# Altium schematic sheet Industrial-Controller_PWR_Switch.SchDoc: DC/DC Step-Down Converter 12V
size 279 x 215 mm; Date: not used; ApprovedBy: not used; CheckedBy: not used; Author: not used; DrawnBy: not used; Organization: not used; Address4: not used; SheetNumber: 4; SheetTotal: 21; Time: not used; ImagePath: not used; Application_BuildNumber: not used
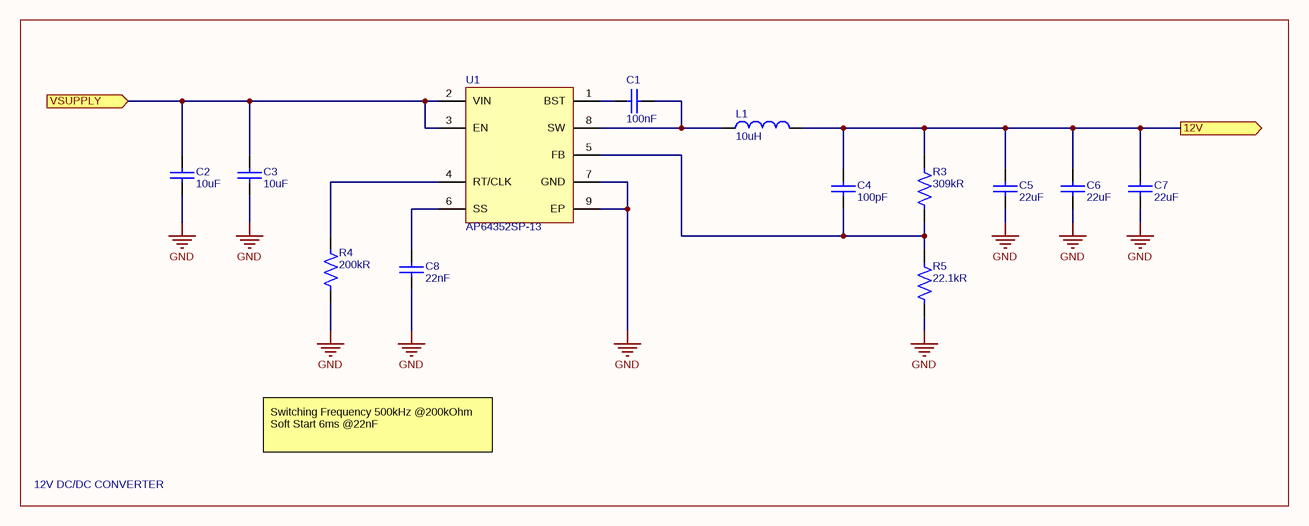
[diagram p0: Industrial-Controller_PWR_Switch.SchDoc]

## Parts
C1  100nF  [CAP_0603]
C2  10uF  [CAP_1210]
C3  10uF  [CAP_1210]
C4  100pF  [CAP_0603]
C5  22uF  [CAP_1210]
C6  22uF  [CAP_1210]
C7  22uF  [CAP_1210]
C8  22nF  [CAP_0603]
L1  10uH  [SRU1048]
R3  309kR  [RES_0603]
R4  200kR  [RES_0603]
R5  22.1kR  [RES_0603]
U1  AP64352SP-13  [SOIC-8EP_150mil]

## Blocks framed on the sheet
12V DC/DC CONVERTER: C1-C8 L1 R3-R5 U1

## Ports
12V (out), VSUPPLY (in)

## Nets
GND: C2.1 C3.1 C5.1 C6.1 C7.1 C8.1 R4.2 R5.2 U1.7(GND) U1.9(EP)
12V: C4.2 C5.2 C6.2 C7.2 L1.2 R3.1 ; port 12V
VSUPPLY: C2.2 C3.2 U1.2(VIN) U1.3(EN) ; port VSUPPLY
NetC1_1: C1.1 L1.1 U1.8(SW)
NetC1_2: C1.2 U1.1(BST)
NetC4_1: C4.1 R3.2 R5.1 U1.5(FB)
NetC8_2: C8.2 U1.6(SS)
NetR4_1: R4.1 U1.4(RT/CLK)

## Notes on the sheet
- Switching Frequency 500kHz @200kOhm
  Soft Start 6ms @22nF
- Title:
- Date:
- Size A
- Project:
- Number:
- Time:
- Sheet
- Revision
- of
- Engineer:
- www.rft.com <http://www.rft.com>
- File:

## Library data of the parts
C1 = CL10B104KB8NNNL: CAP CER 0.1UF 50V X7R 0603; Manufacturer 1: Samsung; Tolerance: 10%; Supplier 1: Digi-Key; Manufacturer Part Number 1: CL10B104KB8NNNL; RoHS: Yes; Category: Ceramic Capacitors; Stock 1: 2348404; Pricing 1: 15000=0,00532, 30000=0,00506 (USD); Mount: Surface Mount; Case/Package: 0603; Min Operating Temperature: -55°C; Max Operating Temperature: 125°C; Capacitance: 100nF; Packaging: Tape and Reel; Package Quantity: 15000; Voltage Rating: 50V; Dielectric: X7R; Voltage Rating (DC): 50V; Series: CL; Construction: Flat; Length: 1.6mm; Width: 0.031inch; Height: 0.8mm; Thickness: 0.035inch; Depth: 0.8mm; Radiation Hardening: No; RoHS Compliant: Yes; ComponentLink1URL: https://datasheet.ciiva.com/26838/getdatasheetpartid-357523-26838415.pdf?src-supplier=Verical; ComponentLink1Description: https://datasheet.ciiva.com/26838/getdatasheetpartid-357523-26838415.pdf?src-supplier=Verical; ComponentLink2URL: https://datasheet.ciiva.com/25741/cl10b104kb8nnnl-25741341.pdf?src-supplier=Digi-Key; ComponentLink2Description: https://datasheet.ciiva.com/25741/cl10b104kb8nnnl-25741341.pdf?src-supplier=Digi-Key; Supplier Part Number 1: 1276-CL10B104KB8NNNLTR-ND
C2 C3 = CL32B106KBJNNWE: CAP CER 10UF 50V X7R 1210; Manufacturer 1: Samsung; Tolerance: 10%; Supplier 1: Digi-Key; Manufacturer Part Number 1: CL32B106KBJNNWE; RoHS: Yes; Category: Ceramic Capacitors; Stock 1: 395336; Pricing 1: 1=0,64000, 10=0,45500, 50=0,34380, 100=0,29940, 500=0,22176 (USD); Mount: Surface Mount; Case/Package: 1210; Case Code (Imperial): 1210; Case Code (Metric): 3225; Min Operating Temperature: -55°C; Max Operating Temperature: 125°C; Dielectric: X7R; Capacitance: 10uF; Voltage Rating: 50V; Package Quantity: 1; Packaging: Tape and Reel; Length: 0.126inch; Width: 0.098inch; Thickness: 0.106inch; Lead Free: Lead Free; ComponentLink1URL: https://datasheet.ciiva.com/25721/cl32b106kbjnnwe-25721651.pdf?src-supplier=Digi-Key; ComponentLink1Description: https://datasheet.ciiva.com/25721/cl32b106kbjnnwe-25721651.pdf?src-supplier=Digi-Key; Supplier Part Number 1: 1276-3388-1-ND
C4 = CL10B101KB8NFNC: CAP CER 100PF 50V X7R 0603; Manufacturer 1: Samsung; Tolerance: 10%; Supplier 1: Digi-Key; Manufacturer Part Number 1: CL10B101KB8NFNC; RoHS: Yes; Category: Ceramic Capacitors; Stock 1: 134085; Pricing 1: 1=0,10000, 10=0,04200, 50=0,02260, 100=0,01850, 500=0,01320, 1000=0,01038 (USD); Mount: Surface Mount; Case/Package: 0603; Case Code (Metric): 1608; Case Code (Imperial): 0603; Contact Plating: Tin; Min Operating Temperature: -55°C; Max Operating Temperature: 125°C; Package Quantity: 1; Packaging: Cut Tape; Capacitance: 100pF; Voltage Rating: 50V; Dielectric: X7R; Termination: Wraparound; Series: CL; Construction: Flat; Length: 0.063inch; Width: 0.031inch; Thickness: 0.035inch; RoHS Compliant: Yes; ComponentLink1URL: https://datasheet.ciiva.com/25739/cl10b101kb8nfnc-25739520.pdf?src-supplier=Digi-Key; ComponentLink1Description: https://datasheet.ciiva.com/25739/cl10b101kb8nfnc-25739520.pdf?src-supplier=Digi-Key; Supplier Part Number 1: 1276-1908-1-ND
C5-C7 = CL32B226KAJNNNE: CAP CER 22UF 25V X7R 1210; Manufacturer 1: Samsung; Material: Ceramic; Tolerance: 10%; Supplier 1: Digi-Key; Manufacturer Part Number 1: CL32B226KAJNNNE; RoHS: Yes; Category: Ceramic Capacitors; Stock 1: 784003; Pricing 1: 1=0,58000, 10=0,41000, 50=0,31000, 100=0,26990, 500=0,19996 (USD); Mount: Surface Mount; Case/Package: 1210; Case Code (Metric): 3225; Case Code (Imperial): 1210; Min Operating Temperature: -55°C; Max Operating Temperature: 125°C; Package Quantity: 1; Packaging: Tape and Reel; Capacitance: 22uF; Voltage Rating: 25V; Dielectric: X7R; Series: CL; Construction: Flat; Voltage Rating (DC): 25V; Length: 3.2mm; Width: 0.098inch; Height: 2.5mm; Thickness: 0.106inch; Depth: 2.5mm; Radiation Hardening: No; RoHS Compliant: Yes; Lead Free: Lead Free; ComponentLink1URL: https://datasheet.ciiva.com/25714/cl32b226kajnnne-25714610.pdf?src-supplier=Digi-Key; ComponentLink1Description: https://datasheet.ciiva.com/25714/cl32b226kajnnne-25714610.pdf?src-supplier=Digi-Key; Supplier Part Number 1: 1276-3392-1-ND
C8 = CL10B223KB8WPNC: CAP CER 0.022UF 50V X7R 0603; Manufacturer 1: Samsung; Tolerance: 10%; Supplier 1: Digi-Key; Manufacturer Part Number 1: CL10B223KB8WPNC; RoHS: Yes; Category: Ceramic Capacitors; Stock 1: 1346669; Pricing 1: 1=0,10000, 10=0,06000, 50=0,03260, 100=0,02660, 500=0,01902, 1000=0,01494 (USD); Mount: Surface Mount; Case/Package: 0603; Case Code (Metric): 1608; Case Code (Imperial): 0603; Min Operating Temperature: -55°C; Max Operating Temperature: 125°C; Capacitance: 22nF; Packaging: Tape and Reel; Voltage Rating: 50V; Features: Soft Termination; Length: 0.063inch; Width: 0.031inch; Thickness: 0.035inch; Ratings: AEC-Q200; RoHS Compliant: Yes; ComponentLink1URL: http://www.samsungsem.com/servlet/FileDownload?type=spec&file=CL10B223KB8WPNC.pdf&src-supplier=Avnet; ComponentLink1Description: http://www.samsungsem.com/servlet/FileDownload?type=spec&file=CL10B223KB8WPNC.pdf&src-supplier=Avnet; ComponentLink2URL: http://www.samsungsem.com/kr/support/product-search/mlcc/CL10B223KB8WPNC.jsp?src-supplier=Digi-Key; ComponentLink2Description: http://www.samsungsem.com/kr/support/product-search/mlcc/CL10B223KB8WPNC.jsp?src-supplier=Digi-Key; ComponentLink3URL: http://www.samsungsem.com/kr/support/library/product-catalog/mlcc.jsp?src-supplier=Digi-Key; ComponentLink3Description: http://www.samsungsem.com/kr/support/library/product-catalog/mlcc.jsp?src-supplier=Digi-Key; Supplier Part Number 1: 1276-6534-1-ND
L1 = SRU1048-100Y: FIXED IND 10UH 4.5A 18.5MOHM SMD; Manufacturer 1: Bourns; Core Material: Ferrite; Tolerance: 30%; DC Resistance (DCR): 18.5mR; Q Factor: 26; Self Resonant Frequency: 16MHz; Saturation Current: 3.7A; Shielding: Shielded; Test Frequency: 100kHz; Supplier 1: Digi-Key; Manufacturer Part Number 1: SRU1048-100Y; RoHS: Yes; Category: Fixed Inductors; Stock 1: 5139; Pricing 1: 1=1,15000, 10=1,06400, 25=0,98200, 50=0,81840, 100=0,76930, 250=0,68744 (USD); Mount: Surface Mount; Case/Package: 1048; Min Operating Temperature: -40°C; Max Operating Temperature: 125°C; Inductance: 10uH; Max DC Current: 4.5A; Inductance Tolerance: 30%; Packaging: Tape and Reel; Package Quantity: 600; Current Rating: 4.5A; Resistor Type: Wirewound; Termination: SMD/SMT; RMS Current (Irms): 4.5A; DC Current: 4.5A; Series: SRU1048; Length: 10mm; Width: 0.394inch; Height: 4.8mm; Height - Seated (Max): 0.201inch; Depth: 10.3mm; Radiation Hardening: No; REACH SVHC: No SVHC; Military Standard: Not; RoHS Compliant: Yes; ComponentLink1URL: https://datasheet.ciiva.com/6160/1776938-6160914.pdf?src-supplier=Farnell; ComponentLink1Description: https://datasheet.ciiva.com/6160/1776938-6160914.pdf?src-supplier=Farnell; ComponentLink2URL: https://datasheet.ciiva.com/22704/1843976-22704103.pdf?src-supplier=Element14; ComponentLink2Description: https://datasheet.ciiva.com/22704/1843976-22704103.pdf?src-supplier=Element14; ComponentLink3URL: https://datasheet.ciiva.com/11799/0900766b80ddd3fc-11799736.pdf?src-supplier=RSComponents; ComponentLink3Description: https://datasheet.ciiva.com/11799/0900766b80ddd3fc-11799736.pdf?src-supplier=RSComponents; ComponentLink4URL: https://datasheet.ciiva.com/1062/sru1048-1062388.pdf?src-supplier=Digi-Key; ComponentLink4Description: https://datasheet.ciiva.com/1062/sru1048-1062388.pdf?src-supplier=Digi-Key; ComponentLink5URL: https://datasheet.ciiva.com/1062/sru1048-1062389.pdf?src-supplier=Digi-Key; ComponentLink5Description: https://datasheet.ciiva.com/1062/sru1048-1062389.pdf?src-supplier=Digi-Key; ComponentLink6URL: https://datasheet.ciiva.com/41680/1776938-41680726.pdf?src-supplier=Newark; ComponentLink6Description: https://datasheet.ciiva.com/41680/1776938-41680726.pdf?src-supplier=Newark; ComponentLink7URL: https://datasheet.ciiva.com/17285/sru1048-17285671.pdf?src-supplier=Avnet+Europe; ComponentLink7Description: https://datasheet.ciiva.com/17285/sru1048-17285671.pdf?src-supplier=Avnet+Europe; ComponentLink8URL: https://datasheet.ciiva.com/16955/70277184-16955738.pdf?src-supplier=Allied+Electronics; ComponentLink8Description: https://datasheet.ciiva.com/16955/70277184-16955738.pdf?src-supplier=Allied+Electronics; ComponentLink9URL: https://datasheet.ciiva.com/31835/1293sru1048-31835886.pdf?src-supplier=Onlinecomponents.com; ComponentLink9Description: https://datasheet.ciiva.com/31835/1293sru1048-31835886.pdf?src-supplier=Onlinecomponents.com; Supplier Part Number 1: SRU1048-100YCT-ND
R3 = RC0603FR-07309KL: RES 309K OHM 1% 1/10W 0603; Manufacturer 1: Yageo; Power Rating: 100mW; Voltage Rating: 50V; Temperature Coefficient: 100ppm/°C; Supplier 1: Digi-Key; Manufacturer Part Number 1: RC0603FR-07309KL; RoHS: Yes; Category: Chip SMD Resistors; Stock 1: 96751; Pricing 1: 1=0,10000, 10=0,02400, 100=0,00970, 1000=0,00436, 2500=0,00378 (USD); Case/Package: 0603; Case Code (Metric): 1608; Case Code (Imperial): 0603; Size Code: 0603; Min Operating Temperature: -55°C; Max Operating Temperature: 155°C; Tolerance: 1%; Package Quantity: 5000; Resistance: 309kR; Packaging: Tape and Reel; Resistor Type: Thick Film; Number of Terminations: 2; Termination: SMD/SMT; Max Power Dissipation: 100mW; Voltage Rating (DC): 50V; Features: Moisture Resistant; Series: RC; Construction: Rectangular; Length: 1.6mm; Width: 0.031inch; Height: 0.022inch; Depth: 0.8mm; Military Standard: Not; Lead Free: Lead Free; RoHS Compliant: Yes; ComponentLink1URL: https://datasheet.ciiva.com/2454/pyu-r-int-thick-7-2454532.pdf?src-supplier=Digi-Key; ComponentLink1Description: https://datasheet.ciiva.com/2454/pyu-r-int-thick-7-2454532.pdf?src-supplier=Digi-Key; ComponentLink2URL: https://datasheet.ciiva.com/2454/pyu-r-int-thick-7-2454533.pdf?src-supplier=Digi-Key; ComponentLink2Description: https://datasheet.ciiva.com/2454/pyu-r-int-thick-7-2454533.pdf?src-supplier=Digi-Key; ComponentLink3URL: https://datasheet.ciiva.com/2454/pyu-r-int-thick-7-2454531.pdf?src-supplier=Digi-Key; ComponentLink3Description: https://datasheet.ciiva.com/2454/pyu-r-int-thick-7-2454531.pdf?src-supplier=Digi-Key; ComponentLink4URL: https://datasheet.ciiva.com/12560/rc0603-272842-12560837.pdf?src-supplier=Mouser; ComponentLink4Description: https://datasheet.ciiva.com/12560/rc0603-272842-12560837.pdf?src-supplier=Mouser; Supplier Part Number 1: 311-309KHRCT-ND
R4 = RC0603FR-07200KL: RES 200K OHM 1% 1/10W 0603; Manufacturer 1: Yageo; Temperature Coefficient: 100ppm/°C; Voltage Rating (DC): 50V; Power Rating: 100mW; Supplier 1: Digi-Key; Manufacturer Part Number 1: RC0603FR-07200KL; RoHS: Yes; Category: Chip SMD Resistors; Stock 1: 693919; Pricing 1: 5000=0,00312 (USD); Case/Package: 0603; Number of Pins: 2; Case Code (Metric): 1608; Case Code (Imperial): 0603; Size Code: 0603; Min Operating Temperature: -55°C; Max Operating Temperature: 155°C; Resistance: 200kR; Tolerance: 1%; Packaging: Tape and Reel; Resistor Type: Thick Film; Voltage Rating: 50V; Package Quantity: 1; Number of Terminations: 2; Termination: SMD/SMT; Max Power Dissipation: 100mW; Features: Moisture Resistant; Series: RC; Resistance Tolerance: 1%; Construction: Rectangular; Length: 1.6mm; Width: 0.031inch; Height: 0.022inch; Depth: 0.8mm; Lead Free: Lead Free; REACH SVHC: No SVHC; Military Standard: Not; RoHS Compliant: Yes; ComponentLink1URL: https://datasheet.ciiva.com/2453/pyu-r-int-thick-7-2453959.pdf?src-supplier=Digi-Key; ComponentLink1Description: https://datasheet.ciiva.com/2453/pyu-r-int-thick-7-2453959.pdf?src-supplier=Digi-Key; ComponentLink2URL: https://datasheet.ciiva.com/2453/pyu-r-int-thick-7-2453960.pdf?src-supplier=Digi-Key; ComponentLink2Description: https://datasheet.ciiva.com/2453/pyu-r-int-thick-7-2453960.pdf?src-supplier=Digi-Key; ComponentLink3URL: https://datasheet.ciiva.com/2453/pyu-r-int-thick-7-2453958.pdf?src-supplier=Digi-Key; ComponentLink3Description: https://datasheet.ciiva.com/2453/pyu-r-int-thick-7-2453958.pdf?src-supplier=Digi-Key; Supplier Part Number 1: 311-200KHRTR-ND
R5 = RC0603FR-0722K1L: RES 22.1K OHM 1% 1/10W 0603; Manufacturer 1: Yageo; Power Rating: 100mW; Voltage Rating: 50V; Temperature Coefficient: 100ppm/°C; Supplier 1: Digi-Key; Manufacturer Part Number 1: RC0603FR-0722K1L; RoHS: Yes; Category: Chip SMD Resistors; Stock 1: 845327; Pricing 1: 1=0,10000, 10=0,02400, 100=0,00970, 1000=0,00436, 2500=0,00378 (USD); Case/Package: 0603; Case Code (Imperial): 0603; Case Code (Metric): 1608; Size Code: 0603; Min Operating Temperature: -55°C; Max Operating Temperature: 155°C; Tolerance: 1%; Package Quantity: 5000; Packaging: Tape and Reel; Resistance: 22.1kR; Termination: SMD/SMT; Voltage Rating (DC): 50V; Series: RC; Length: 1.6mm; Width: 0.8mm; Height: 0.45mm; Lead Free: Lead Free; RoHS Compliant: Yes; ComponentLink1URL: https://datasheet.ciiva.com/12555/rc0603-272842-12555287.pdf?src-supplier=Mouser; ComponentLink1Description: https://datasheet.ciiva.com/12555/rc0603-272842-12555287.pdf?src-supplier=Mouser; Supplier Part Number 1: 311-22.1KHRCT-ND
U1 = AP64352SP-13: IC DCDC CONV BUCK 3.5A SO-8EP; Manufacturer 1: Diodes; Supplier 1: Digi-Key; Manufacturer Part Number 1: AP64352SP-13; RoHS: Yes; Category: Voltage Regulators - Switching; Stock 1: 134; Pricing 1: 1=1,66000, 10=1,48100, 25=1,40560, 100=1,15460, 250=1,07932, 500=0,95382, 1000=0,75301 (USD); Supplier Part Number 1: 31-AP64352SP-13CT-ND